# EasyEDA Pro project Mixer.eprj

# Schematic Mixer
Create Date: 2024-08-12; Page Name: P1; Project Name: Mixer; Schematic Name: Mixer; Update Date: 2024-08-12; Company: EasyEDA.com; Drawn: EasyEDA; Page Size: A4; Part Number: JLCPCB-002; Reviewed: EasyEDA; Version: V0.1
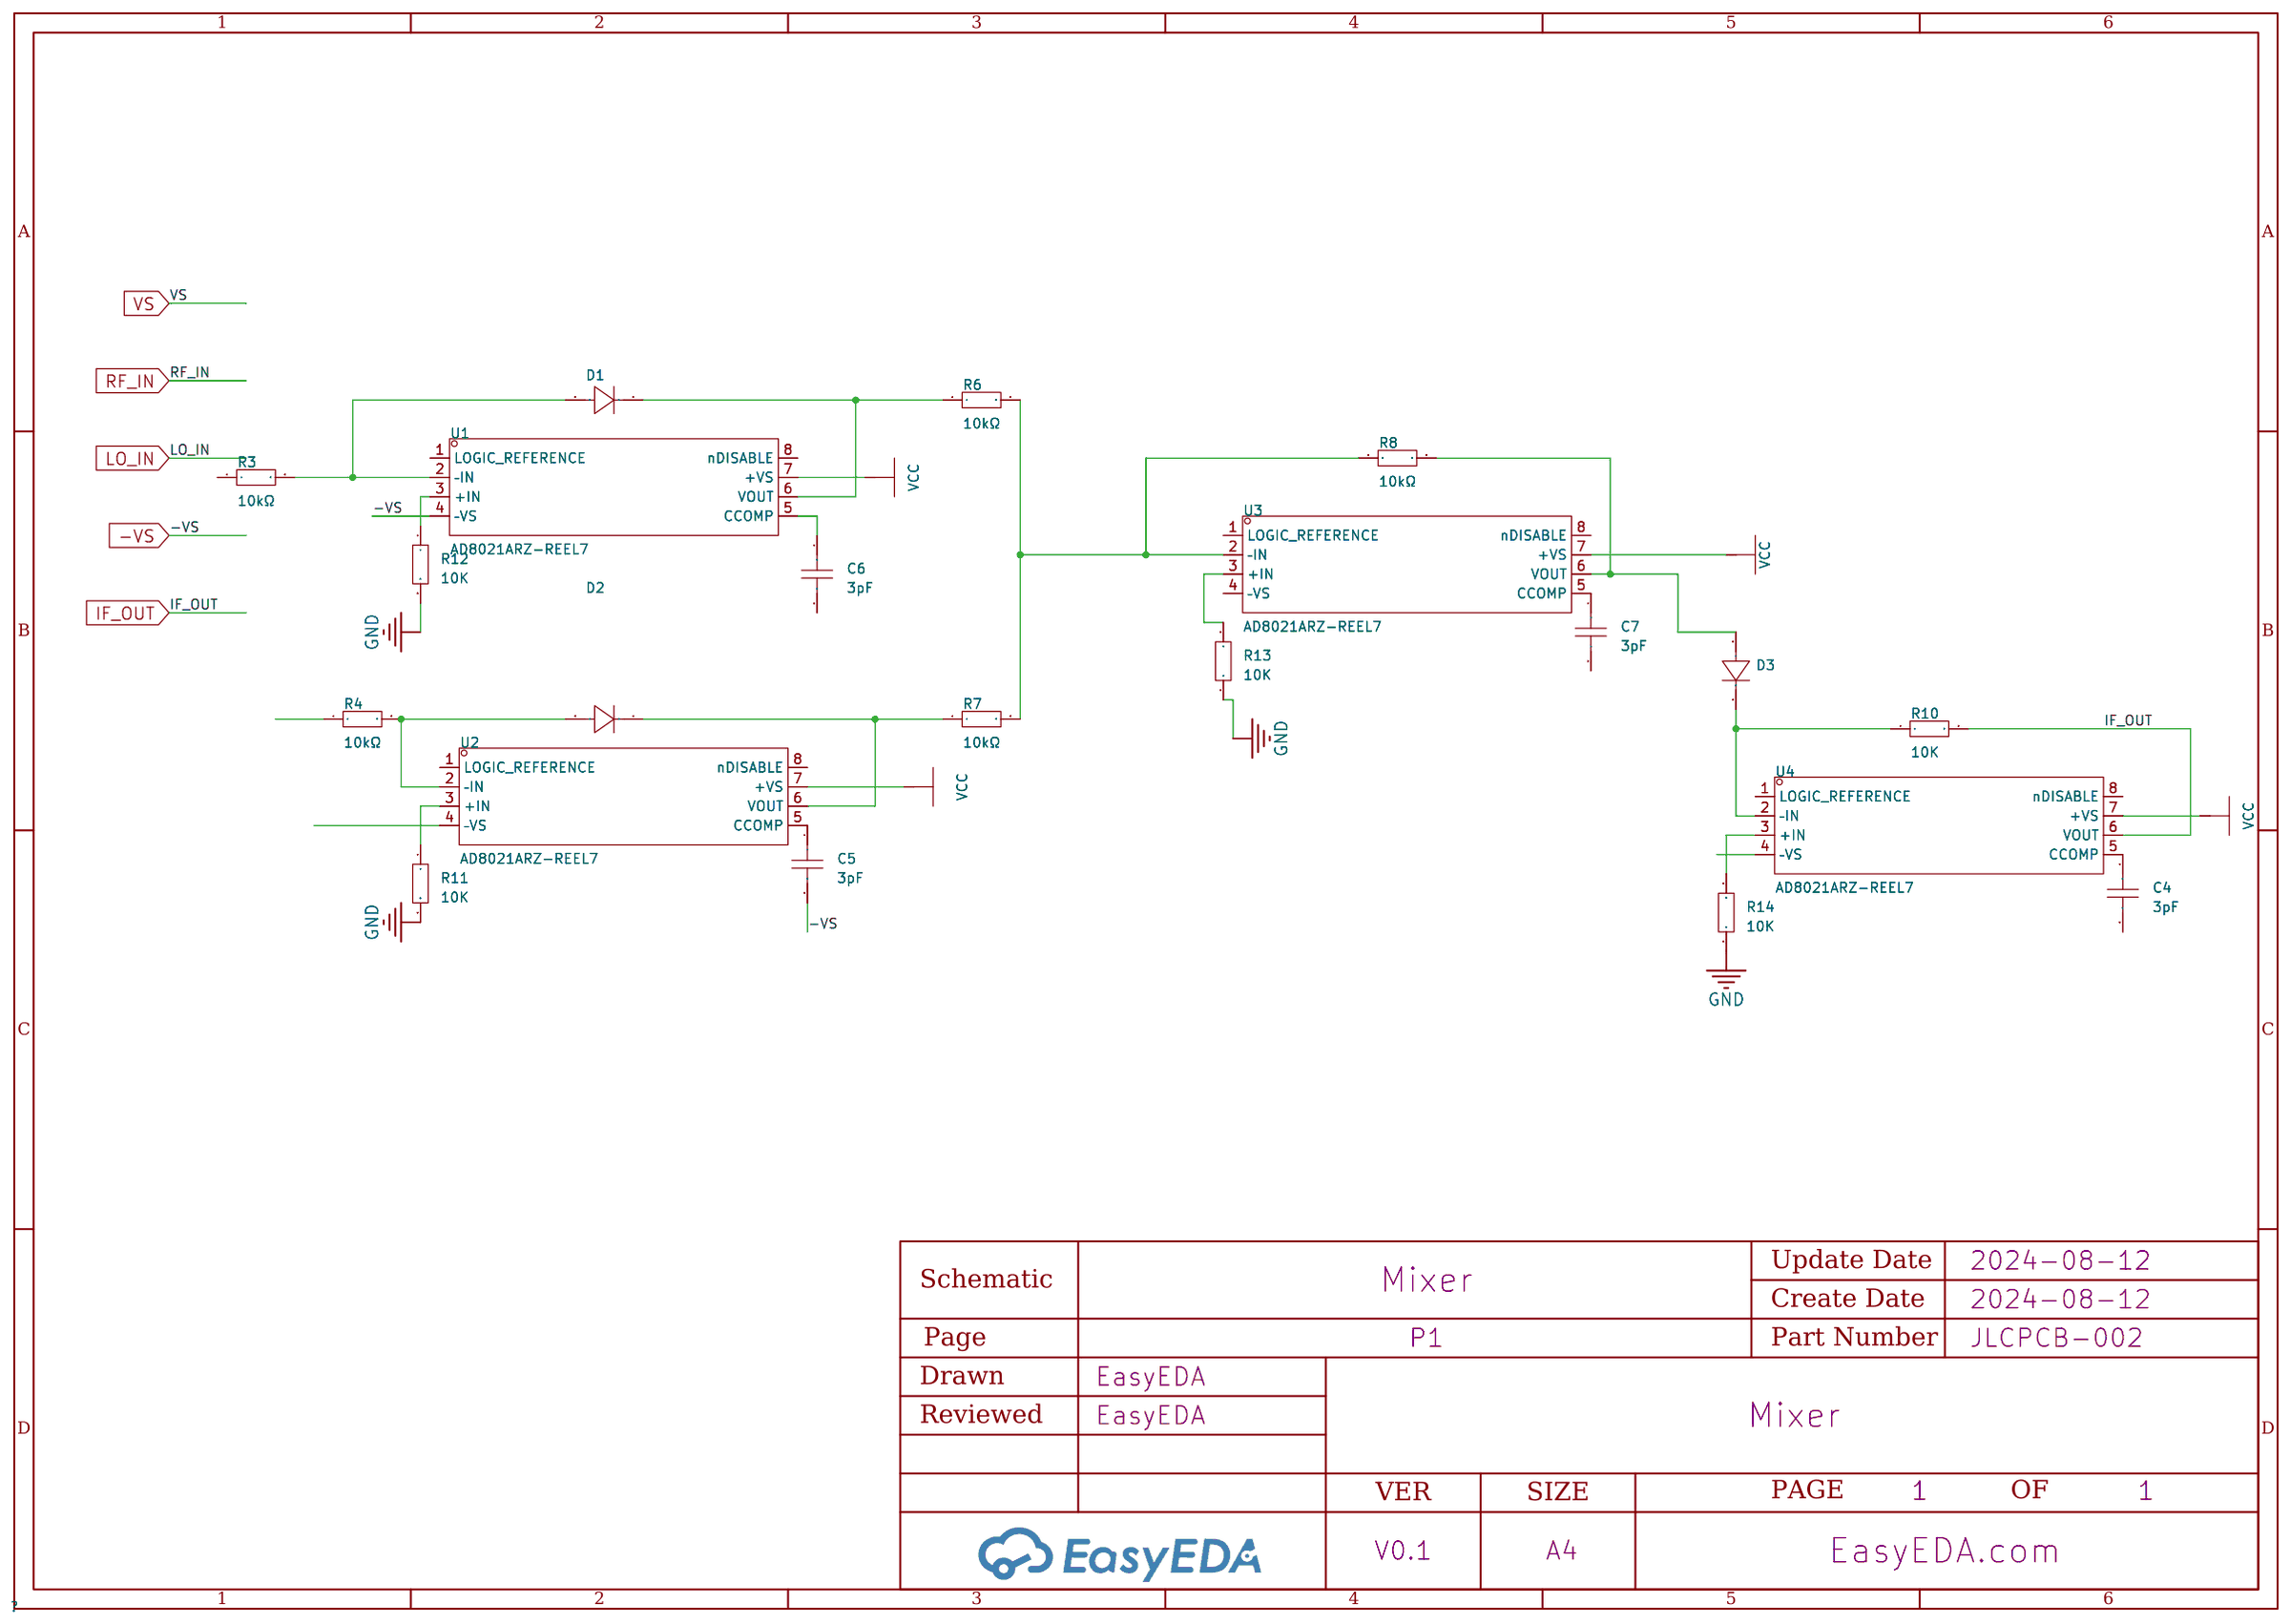
[diagram p0: schematic sheet]

## Parts
C4  3pF  [C0201]
C5  3pF  [C0201]
C6  3pF  [C0201]
C7  3pF  [C0201]
D1  -  [DO-41_BD2.4-L4.7-P8.70-D0.9-RD]
D2  -  [DO-41_BD2.4-L4.7-P8.70-D0.9-RD]
D3  -  [DO-41_BD2.4-L4.7-P8.70-D0.9-RD]
R3  10kΩ  [RES-TH_BD1.8-L3.2-P7.20-D0.4]
R4  10kΩ  [RES-TH_BD1.8-L3.2-P7.20-D0.4]
R6  10kΩ  [RES-TH_BD1.8-L3.2-P7.20-D0.4]
R7  10kΩ  [RES-TH_BD1.8-L3.2-P7.20-D0.4]
R8  10kΩ  [RES-TH_BD1.8-L3.2-P7.20-D0.4]
R10  10K  [R0603]
R11  10K  [R0201]
R12  10K  [R0201]
R13  10K  [R0201]
R14  10K  [R0201]
U1  AD8021ARZ-REEL7  [SOIC-8_L4.9-W3.9-P1.27-LS6.0-BL-2]
U2  AD8021ARZ-REEL7  [SOIC-8_L4.9-W3.9-P1.27-LS6.0-BL-2]
U3  AD8021ARZ-REEL7  [SOIC-8_L4.9-W3.9-P1.27-LS6.0-BL-2]
U4  AD8021ARZ-REEL7  [SOIC-8_L4.9-W3.9-P1.27-LS6.0-BL-2]

## Library data of the parts
C4-C7 = CAP_0201: Supplier Footprint: 0201
D1-D3 = 1N4007: Supplier Footprint: DO-41
R3 R4 R6-R8 = Res_AXIAL-1/8W: Supplier Footprint: Through
R10 = Res_0603: Supplier Footprint: 0603
R11-R14 = Res_0201: Supplier Footprint: 0201
U1-U4 = AD8021ARZ-REEL7: Supplier Part: C17135; Manufacturer: ADI(亚德诺); Supplier Footprint: SOIC-8; JLCPCB Part Class: Extended Part; Datasheet: https://atta.szlcsc.com/upload/public/pdf/source/20140724/1457707162204.pdf; Supplier: LCSC

## Nets
GND: R11.2 R12.2 R13.1 R14.1
VCC: U1.7(+VS) U2.7(+VS) U3.7(+VS) U4.7(+VS)
-VS: C5.2 U1.4(–VS)
IF_OUT: R10.2 U4.6(VOUT)
$1N1108: R12.1 U1.3(+IN)
$1N1112: R11.1 U2.3(+IN)
$1N1502: D1.2(A) R3.2 U1.2(–IN)
$1N1824: D2.2(A) R4.2 U2.2(–IN)
$1N1902: C6.1 U1.5(CCOMP)
$1N2101: R13.2 U3.3(+IN)
$1N2168: D1.1(K) R6.1 U1.6(VOUT)
$1N2187: D2.1(K) R7.1 U2.6(VOUT)
$1N2284: R6.2 R7.2 R8.1 U3.2(–IN)
$1N2442: R14.2 U4.3(+IN)
$1N2539: D3.1(K) R10.1 U4.2(–IN)
$1N2560: D3.2(A) R8.2 U3.6(VOUT)
$1N2602: C4.1 U4.5(CCOMP)
$1N2663: C5.1 U2.5(CCOMP)
$1N2716: C7.1 U3.5(CCOMP)

Not connected (* = marked no-connect by the designer): C4 2; C6 2; C7 2; R3 1; R4 1; U1 1(LOGIC_REFERENCE) 8(nDISABLE); U2 1(LOGIC_REFERENCE) 4(–VS) 8(nDISABLE); U3 1(LOGIC_REFERENCE) 4(–VS) 8(nDISABLE); U4 1(LOGIC_REFERENCE) 4(–VS) 8(nDISABLE)

# Board Mixer
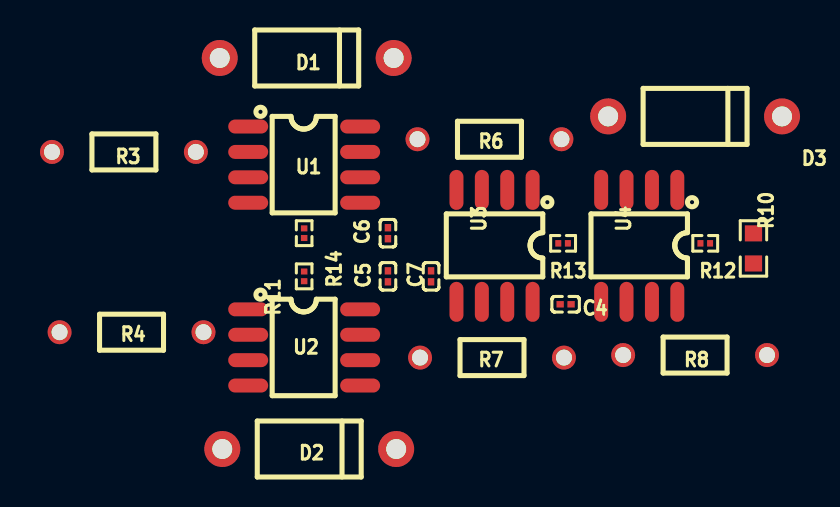
[diagram p1: board, top side]
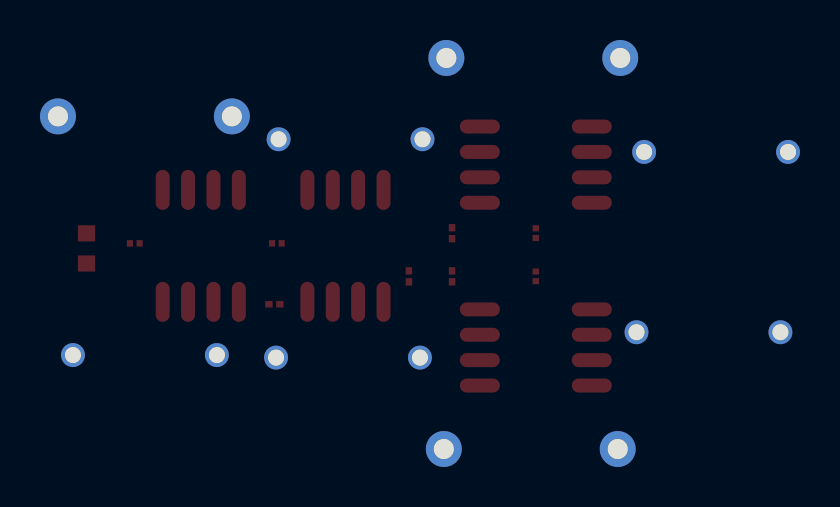
[diagram p2: board, bottom side, seen from below]

No outline. copper layers: Top Layer, Bottom Layer. Coordinates in mm from the lowest, leftmost part position.
Stack: Top Layer 0.035mm / Dielectric1 1.51mm FR4 er 4.5 / Bottom Layer 0.035mm

## Design rules (mm)
template: JLCPCB Capability(Two Layers Board)
spacing copperThickness1oz (default): track to track 0.102, other pairs 0.152 to 0.3
spacing copperThickness2oz: track to track 0.203, other pairs 0.152 to 0.3
track width copperThickness1oz (default): min 0.127, default 0.254, max 2.54
track width copperThickness2oz: min 0.203, default 0.254, max 2.54
differential pair differentialPair (default): width min 0.127, default 0.254, max 2.54; gap min 0.152, default 0.152
via viaSize (default): diameter min 0.5, default 0.61, max 10; hole min 0.3, default 0.305, max 6.3

## Placement (name value [footprint] x y rotation side)
C4  3pF  [C0201]  22.1 7.24 180 top
C5  3pF  [C0201]  13.21 8.64 90 top
C6  3pF  [C0201]  13.21 10.8 90 top
C7  3pF  [C0201]  15.37 8.64 90 top
D1  -  [DO-41_BD2.4-L4.7-P8.70-D0.9-RD]  9.14 19.56 180 top
D2  -  [DO-41_BD2.4-L4.7-P8.70-D0.9-RD]  9.27 0 180 top
D3  -  [DO-41_BD2.4-L4.7-P8.70-D0.9-RD]  28.57 16.64 180 top
R3  10kΩ  [RES-TH_BD1.8-L3.2-P7.20-D0.4]  0 14.86 0 top
R4  10kΩ  [RES-TH_BD1.8-L3.2-P7.20-D0.4]  0.38 5.84 0 top
R6  10kΩ  [RES-TH_BD1.8-L3.2-P7.20-D0.4]  18.29 15.49 0 top
R7  10kΩ  [RES-TH_BD1.8-L3.2-P7.20-D0.4]  18.41 4.57 0 top
R8  10kΩ  [RES-TH_BD1.8-L3.2-P7.20-D0.4]  28.57 4.7 180 top
R10  10K  [R0603]  31.5 10.03 270 top
R11  10K  [R0201]  9.02 10.8 90 top
R12  10K  [R0201]  29.08 10.29 0 top
R13  10K  [R0201]  21.97 10.29 180 top
R14  10K  [R0201]  9.02 8.64 270 top
U1  AD8021ARZ-REEL7  [SOIC-8_L4.9-W3.9-P1.27-LS6.0-BL-2]  9.02 14.22 270 top
U2  AD8021ARZ-REEL7  [SOIC-8_L4.9-W3.9-P1.27-LS6.0-BL-2]  9.02 5.08 270 top
U3  AD8021ARZ-REEL7  [SOIC-8_L4.9-W3.9-P1.27-LS6.0-BL-2]  18.54 10.16 180 top
U4  AD8021ARZ-REEL7  [SOIC-8_L4.9-W3.9-P1.27-LS6.0-BL-2]  25.78 10.16 180 top

## Footprints (pads in the part's own frame, mm; a bottom-side part is the same pattern mirrored in y, then rotated)
C0201
  rect 0.368x0.324 smd: 1(-0.275,0) 2(0.275,0)
DO-41_BD2.4-L4.7-P8.70-D0.9-RD
  round 1.8 hole 1: 1(-4.35,0) 2(4.35,0)
R0201
  rect 0.303x0.324 smd: 1(-0.241,0) 2(0.241,0)
R0603
  rect 0.806x0.864 smd: 1(-0.753,0) 2(0.753,0)
RES-TH_BD1.8-L3.2-P7.20-D0.4
  round 1.2 hole 0.8: 1(-3.6,0) 2(3.6,0)
SOIC-8_L4.9-W3.9-P1.27-LS6.0-BL-2
  oval 0.7x2 smd: 1(-1.905,-2.8) 2(-0.635,-2.8) 3(0.635,-2.8) 4(1.905,-2.8) 5(1.905,2.8) 6(0.635,2.8) 7(-0.635,2.8) 8(-1.905,2.8)

## Nets
As in the schematic, except:
-VS: C5.2 C6.2 U1.4 U2.4

Pads without a net: C4 2; C7 2; U1 1 8; U2 1 8; U3 1 8; U4 1 8
